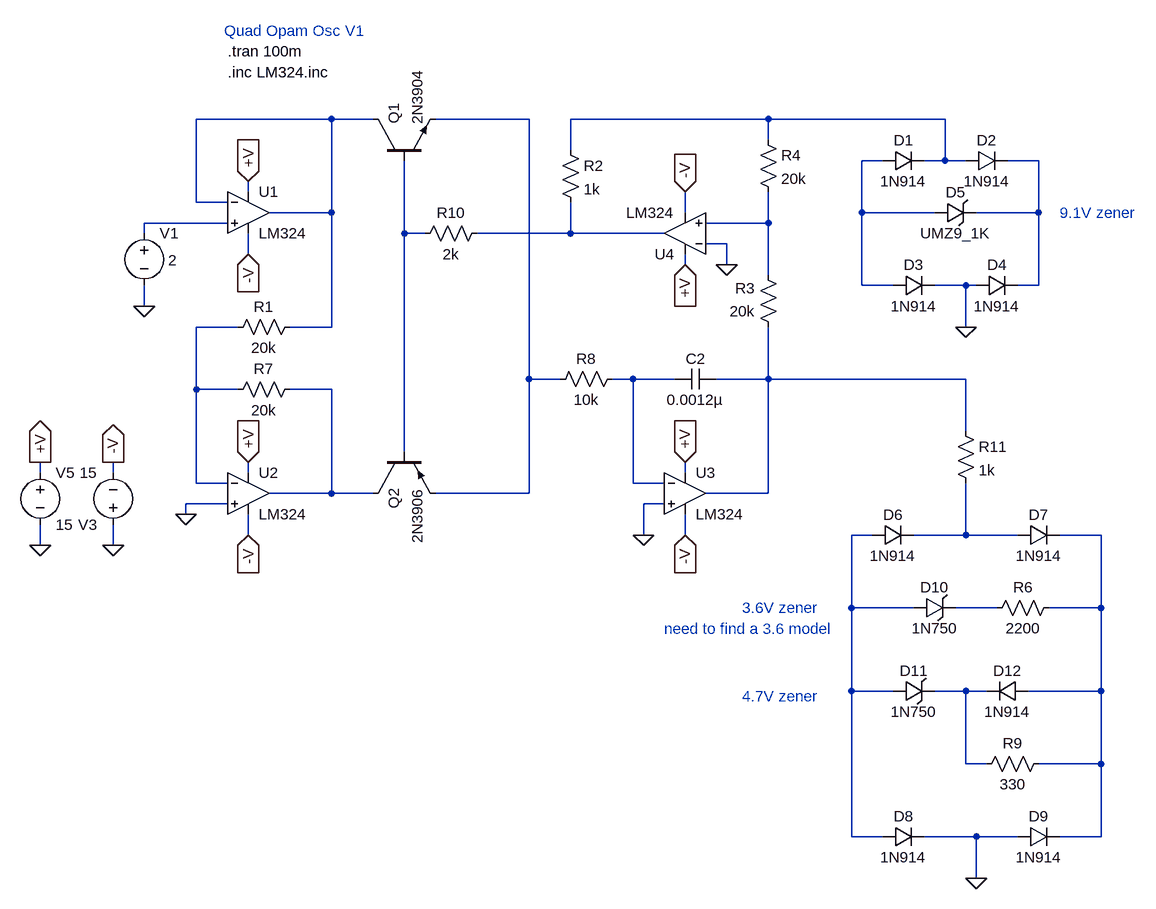
[diagram p0: schematic Quad_Opam_Osc_v1.asc]
Quad_Opam_Osc_v1.asc, the LTspice schematic file:
Version 4
SHEET 1 3256 1268
WIRE 1104 80 896 80
WIRE 1168 80 1104 80
WIRE 1408 80 1264 80
WIRE 1776 80 1472 80
WIRE 2048 80 1776 80
WIRE 1776 112 1776 80
WIRE 1472 128 1472 80
WIRE 1952 144 1920 144
WIRE 2048 144 2048 80
WIRE 2048 144 2016 144
WIRE 2080 144 2048 144
WIRE 2192 144 2144 144
WIRE 976 192 976 176
WIRE 896 208 896 80
WIRE 944 208 896 208
WIRE 1104 224 1104 80
WIRE 1104 224 1008 224
WIRE 1648 224 1648 192
WIRE 1920 224 1920 144
WIRE 2032 224 1920 224
WIRE 2192 224 2192 144
WIRE 2192 224 2096 224
WIRE 944 240 816 240
WIRE 1776 240 1776 192
WIRE 1776 240 1680 240
WIRE 816 256 816 240
WIRE 1216 256 1216 144
WIRE 1248 256 1216 256
WIRE 1472 256 1472 208
WIRE 1472 256 1328 256
WIRE 1616 256 1472 256
WIRE 1712 272 1680 272
WIRE 976 288 976 256
WIRE 1648 304 1648 288
WIRE 1712 304 1712 272
WIRE 1776 320 1776 240
WIRE 1920 336 1920 224
WIRE 1968 336 1920 336
WIRE 2080 336 2032 336
WIRE 2096 336 2080 336
WIRE 2192 336 2192 224
WIRE 2192 336 2160 336
WIRE 816 368 816 336
WIRE 960 400 896 400
WIRE 1104 400 1104 224
WIRE 1104 400 1040 400
WIRE 2080 400 2080 336
WIRE 1408 480 1408 80
WIRE 1456 480 1408 480
WIRE 1568 480 1536 480
WIRE 1632 480 1568 480
WIRE 1776 480 1776 400
WIRE 1776 480 1696 480
WIRE 2080 480 1776 480
WIRE 896 496 896 400
WIRE 960 496 896 496
WIRE 1104 496 1040 496
WIRE 2080 560 2080 480
WIRE 1216 592 1216 256
WIRE 656 624 656 608
WIRE 768 624 768 608
WIRE 976 624 976 608
WIRE 1648 624 1648 608
WIRE 896 640 896 496
WIRE 944 640 896 640
WIRE 1568 640 1568 480
WIRE 1616 640 1568 640
WIRE 1104 656 1104 496
WIRE 1104 656 1008 656
WIRE 1168 656 1104 656
WIRE 1408 656 1408 480
WIRE 1408 656 1264 656
WIRE 1776 656 1776 480
WIRE 1776 656 1680 656
WIRE 944 672 880 672
WIRE 1616 672 1584 672
WIRE 880 688 880 672
WIRE 976 720 976 688
WIRE 1584 720 1584 672
WIRE 1648 720 1648 688
WIRE 1936 720 1904 720
WIRE 2080 720 2080 640
WIRE 2080 720 2000 720
WIRE 2160 720 2080 720
WIRE 2288 720 2224 720
WIRE 656 736 656 704
WIRE 768 736 768 704
WIRE 1904 832 1904 720
WIRE 2000 832 1904 832
WIRE 2128 832 2064 832
WIRE 2288 832 2288 720
WIRE 2288 832 2208 832
WIRE 1904 960 1904 832
WIRE 1968 960 1904 960
WIRE 2080 960 2032 960
WIRE 2112 960 2080 960
WIRE 2288 960 2288 832
WIRE 2288 960 2176 960
WIRE 2080 1072 2080 960
WIRE 2112 1072 2080 1072
WIRE 2288 1072 2288 960
WIRE 2288 1072 2192 1072
WIRE 1904 1184 1904 960
WIRE 1952 1184 1904 1184
WIRE 2096 1184 2016 1184
WIRE 2160 1184 2096 1184
WIRE 2288 1184 2288 1072
WIRE 2288 1184 2224 1184
WIRE 2096 1248 2096 1184
FLAG 976 176 +V
IOPIN 976 176 In
FLAG 976 608 +V
IOPIN 976 608 In
FLAG 816 368 0
FLAG 656 736 0
FLAG 656 608 +V
IOPIN 656 608 Out
FLAG 768 736 0
FLAG 768 608 -V
IOPIN 768 608 Out
FLAG 976 288 -V
IOPIN 976 288 In
FLAG 976 720 -V
IOPIN 976 720 In
FLAG 1584 720 0
FLAG 880 688 0
FLAG 1648 608 +V
IOPIN 1648 608 In
FLAG 1648 720 -V
IOPIN 1648 720 In
FLAG 1648 304 +V
IOPIN 1648 304 In
FLAG 1648 192 -V
IOPIN 1648 192 In
FLAG 1712 304 0
FLAG 2080 400 0
FLAG 2096 1248 0
SYMBOL res 1344 240 R90
WINDOW 0 0 56 VBottom 2
WINDOW 3 32 56 VTop 2
SYMATTR InstName R10
SYMATTR Value 2k
SYMBOL Opamps\\opamp2 976 160 R0
SYMATTR InstName U1
SYMATTR Value LM324
SYMATTR SpiceModel LM324
SYMBOL Opamps\\opamp2 976 592 R0
SYMATTR InstName U2
SYMATTR Value LM324
SYMATTR SpiceModel LM324
SYMBOL res 1056 384 R90
WINDOW 0 0 56 VBottom 2
WINDOW 3 32 56 VTop 2
SYMATTR InstName R1
SYMATTR Value 20k
SYMBOL res 1456 112 R0
SYMATTR InstName R2
SYMATTR Value 1k
SYMBOL res 1760 96 R0
SYMATTR InstName R4
SYMATTR Value 20k
SYMBOL res 1056 480 R90
WINDOW 0 0 56 VBottom 2
WINDOW 3 32 56 VTop 2
SYMATTR InstName R7
SYMATTR Value 20k
SYMBOL res 1552 464 R90
WINDOW 0 0 56 VBottom 2
WINDOW 3 32 56 VTop 2
SYMATTR InstName R8
SYMATTR Value 10k
SYMBOL res 1792 416 R180
WINDOW 0 36 76 Left 2
WINDOW 3 36 40 Left 2
SYMATTR InstName R3
SYMATTR Value 20k
SYMBOL cap 1696 464 R90
WINDOW 0 0 32 VBottom 2
WINDOW 3 32 32 VTop 2
SYMATTR InstName C2
SYMATTR Value 0.0012µ
SYMBOL voltage 816 240 R0
WINDOW 123 0 0 Left 2
WINDOW 39 0 0 Left 2
WINDOW 3 37 57 Left 2
SYMATTR Value 2
SYMATTR InstName V1
SYMBOL voltage 656 608 R0
WINDOW 123 0 0 Left 2
WINDOW 39 0 0 Left 2
SYMATTR InstName V5
SYMATTR Value 15
SYMBOL res 2064 544 R0
SYMATTR InstName R11
SYMATTR Value 1k
SYMBOL voltage 768 720 R180
WINDOW 123 0 0 Left 2
WINDOW 39 0 0 Left 2
SYMATTR InstName V3
SYMATTR Value 15
SYMBOL npn 1168 144 R270
SYMATTR InstName Q1
SYMATTR Value 2N3904
SYMBOL pnp 1168 592 M90
SYMATTR InstName Q2
SYMATTR Value 2N3906
SYMBOL Opamps\\opamp2 1648 592 R0
SYMATTR InstName U3
SYMATTR Value LM324
SYMATTR SpiceModel LM324
SYMBOL Opamps\\opamp2 1648 320 R180
SYMATTR InstName U4
SYMATTR Value LM324
SYMATTR SpiceModel LM324
SYMBOL diode 1952 128 M90
WINDOW 0 0 32 VBottom 2
WINDOW 3 32 32 VTop 2
SYMATTR InstName D1
SYMATTR Value 1N914
SYMBOL diode 2080 128 M90
WINDOW 0 0 32 VBottom 2
WINDOW 3 32 32 VTop 2
SYMATTR InstName D2
SYMATTR Value 1N914
SYMBOL diode 1968 320 M90
WINDOW 0 0 32 VBottom 2
WINDOW 3 32 32 VTop 2
SYMATTR InstName D3
SYMATTR Value 1N914
SYMBOL diode 2096 320 M90
WINDOW 0 0 32 VBottom 2
WINDOW 3 32 32 VTop 2
SYMATTR InstName D4
SYMATTR Value 1N914
SYMBOL zener 2032 208 M90
WINDOW 0 0 32 VBottom 2
WINDOW 3 32 32 VTop 2
SYMATTR InstName D5
SYMATTR Value UMZ9_1K
SYMATTR Description Diode
SYMATTR Type diode
SYMBOL diode 1936 704 M90
WINDOW 0 0 32 VBottom 2
WINDOW 3 32 32 VTop 2
SYMATTR InstName D6
SYMATTR Value 1N914
SYMBOL diode 2160 704 M90
WINDOW 0 0 32 VBottom 2
WINDOW 3 32 32 VTop 2
SYMATTR InstName D7
SYMATTR Value 1N914
SYMBOL diode 1952 1168 M90
WINDOW 0 0 32 VBottom 2
WINDOW 3 32 32 VTop 2
SYMATTR InstName D8
SYMATTR Value 1N914
SYMBOL diode 2160 1168 M90
WINDOW 0 0 32 VBottom 2
WINDOW 3 32 32 VTop 2
SYMATTR InstName D9
SYMATTR Value 1N914
SYMBOL zener 2000 816 M90
WINDOW 0 0 32 VBottom 2
WINDOW 3 32 32 VTop 2
SYMATTR InstName D10
SYMATTR Value 1N750
SYMATTR Description Diode
SYMATTR Type diode
SYMBOL res 2224 816 R90
WINDOW 0 0 56 VBottom 2
WINDOW 3 32 56 VTop 2
SYMATTR InstName R6
SYMATTR Value 2200
SYMBOL res 2208 1056 R90
WINDOW 0 0 56 VBottom 2
WINDOW 3 32 56 VTop 2
SYMATTR InstName R9
SYMATTR Value 330
SYMBOL zener 1968 944 M90
WINDOW 0 0 32 VBottom 2
WINDOW 3 32 32 VTop 2
SYMATTR InstName D11
SYMATTR Value 1N750
SYMATTR Description Diode
SYMATTR Type diode
SYMBOL diode 2176 944 R90
WINDOW 0 0 32 VBottom 2
WINDOW 3 32 32 VTop 2
SYMATTR InstName D12
SYMATTR Value 1N914
TEXT 944 -24 Left 2 !.tran 100m
TEXT 1048 -40 Bottom 2 ;Quad Opam Osc V1
TEXT 944 8 Left 2 !.inc LM324.inc
TEXT 2224 224 Left 2 ;9.1V zener
TEXT 1736 968 Left 2 ;4.7V zener
TEXT 1736 832 Left 2 ;3.6V zener
TEXT 1616 864 Left 2 ;need to find a 3.6 model

The netlist it stands for:
* Quad_Opam_Osc_v1.asc
R10 N009 N008 2k
XU1 N006 N001 +V -V N001 LM324 LM324  ; pins In+ In- V+ V- OUT
XU2 0 N010 +V -V N013 LM324 LM324  ; pins In+ In- V+ V- OUT
R1 N001 N010 20k
R2 N003 N009 1k
R4 N003 N007 20k
R7 N013 N010 20k
R8 N011 N002 10k
R3 N012 N007 20k
C2 N012 N011 0.0012µ
V1 N006 0 2
V5 +V 0 15
R11 N012 N015 1k
V3 0 -V 15
Q1 N001 N008 N002 0 2N3904
Q2 N013 N008 N002 0 2N3906
XU3 0 N011 +V -V N012 LM324 LM324  ; pins In+ In- V+ V- OUT
XU4 N007 0 +V -V N009 LM324 LM324  ; pins In+ In- V+ V- OUT
D1 N004 N003 1N914
D2 N003 N005 1N914
D3 N004 0 1N914
D4 0 N005 1N914
D5 N004 N005 UMZ9_1K
D6 N014 N015 1N914
D7 N015 N016 1N914
D8 N014 0 1N914
D9 0 N016 1N914
D10 N014 N017 1N750
R6 N016 N017 2200
R9 N016 N018 330
D11 N014 N018 1N750
D12 N016 N018 1N914
.model D D
.lib standard.dio
.model NPN NPN
.model PNP PNP
.lib standard.bjt
.tran 100m
* Quad Opam Osc V1
.inc LM324.inc
* 9.1V zener
* 4.7V zener
* 3.6V zener
* need to find a 3.6 model
.backanno
.end